# EAGLE design Dual_7seg_Rev0 (EAGLE 7.7.0)
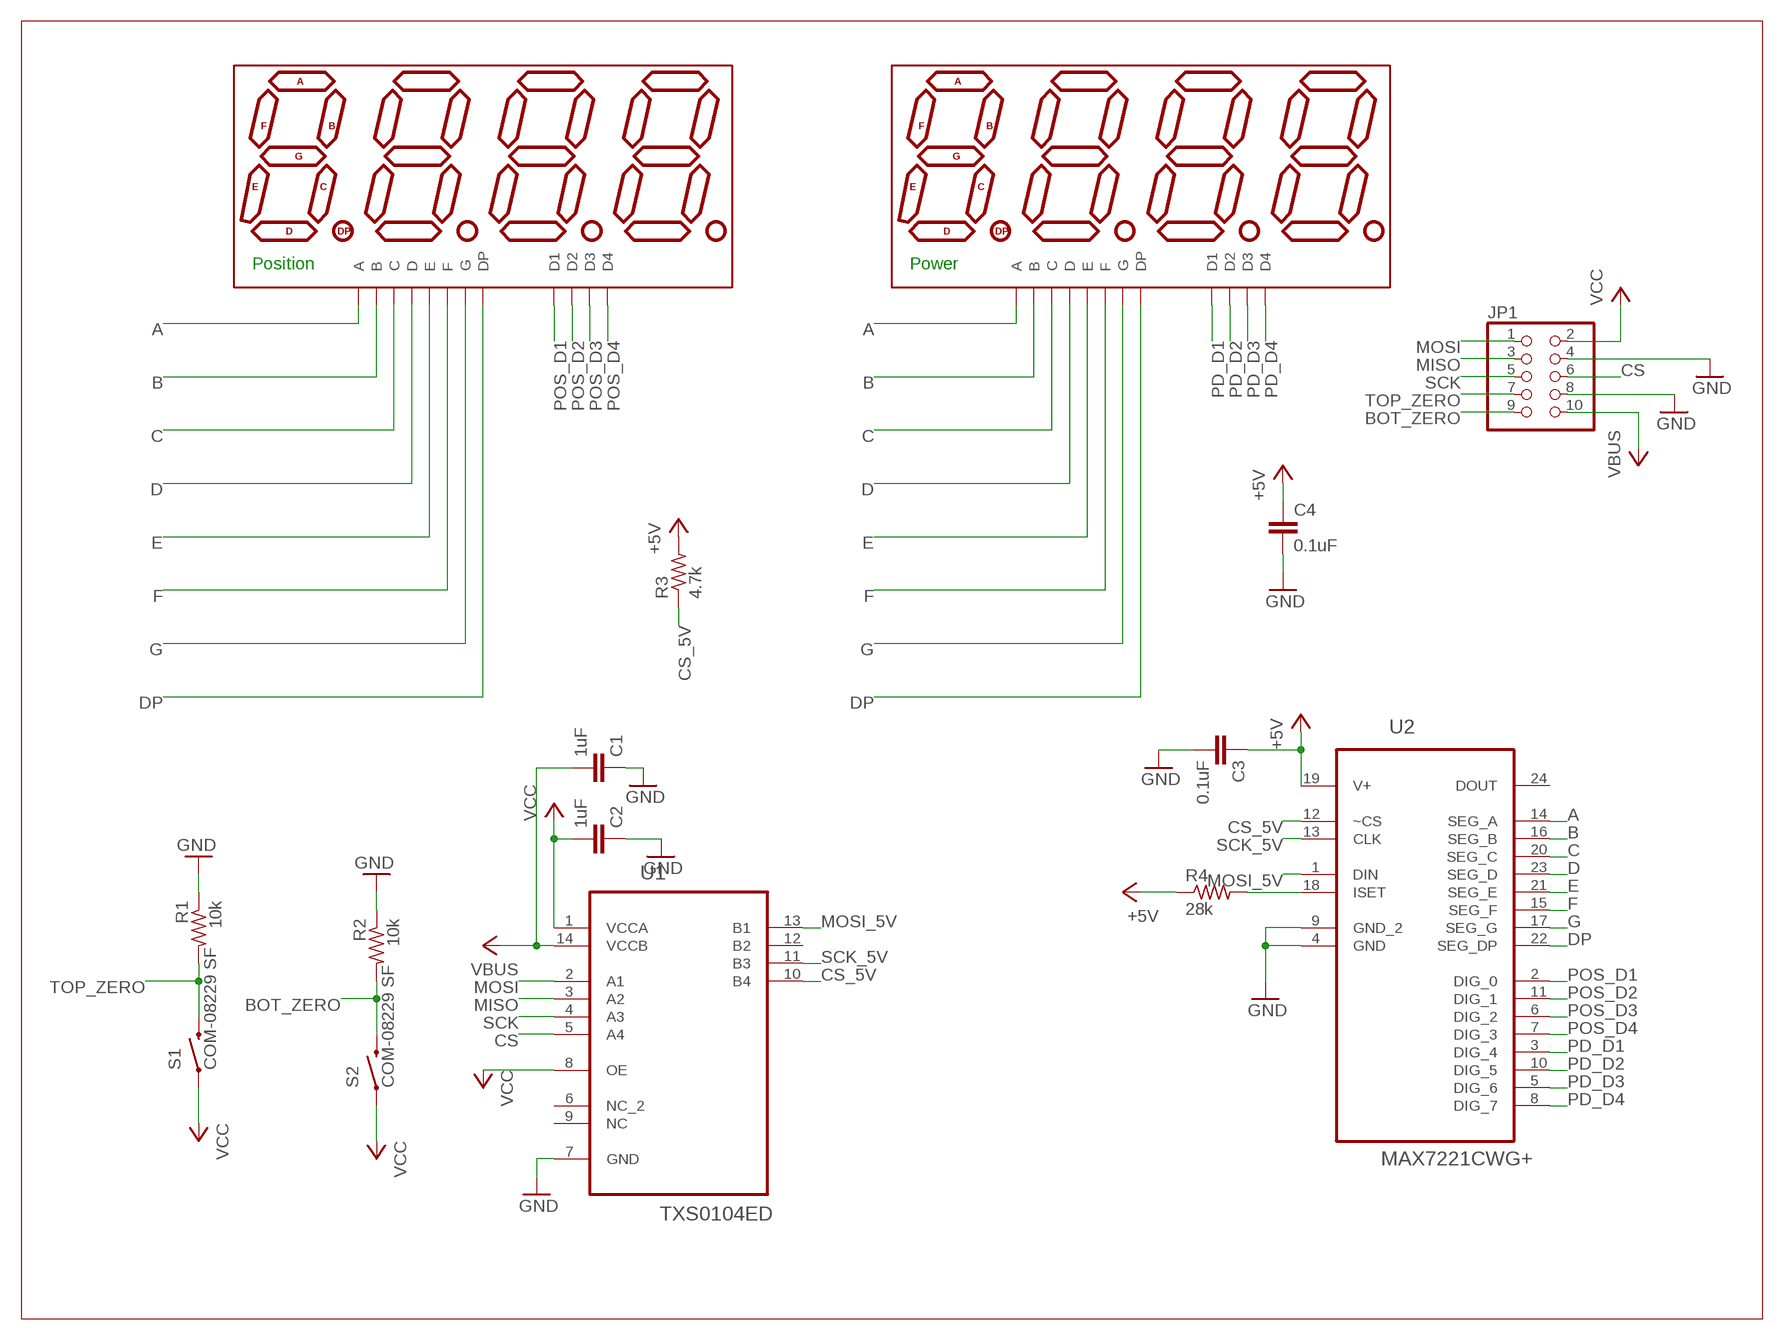
[diagram p0: schematic, sheet 1]

## Parts
C1  1uF  C-EUC0402  [C0402]
C2  1uF  C-EUC0402  [C0402]
C3  0.1uF  C-EUC0402  [C0402]
C4  0.1uF  C-EUC0402  [C0402]
DISP1  ATA8041AW  7-SEGMENT-4DIGIT-20MM-WHITE  [7-SEGMENT-4DIGIT-20MM]
DISP2  ATA8041AW  7-SEGMENT-4DIGIT-20MM-WHITE  [7-SEGMENT-4DIGIT-20MM]
JP1  PINHD-2X5  [2X05]
R1  10k  R-US_R0402  [R0402]
R2  10k  R-US_R0402  [R0402]
R3  4.7k  R-US_R0402  [R0402]
R4  28k  R-US_R0402  [R0402]
S1  COM-08229 SF  SWITCH-MOMENTARY-2SMD-1101NE  [TACTILE-SWITCH-1101NE]
S2  COM-08229 SF  SWITCH-MOMENTARY-2SMD-1101NE  [TACTILE-SWITCH-1101NE]
U1  TXS0104ED  [SOIC127P600X175-14N]
U2  MAX7221CWG+  [SOIC127P1032X265-24N]

## Nets
+5V: C1.2 C3.1 C4.1 JP1.10 R3.2 R4.1 U1.14(VCCB) U2.19(V+) ; supply symbol labelled VBUS
A: DISP1.11(A) DISP2.11(A) U2.14(SEG_A)
B: DISP1.7(B) DISP2.7(B) U2.16(SEG_B)
BOT_ZERO: JP1.9 R2.2 S2.2
C: DISP1.4(C) DISP2.4(C) U2.20(SEG_C)
CS: JP1.6 U1.5(A4)
CS_5V: R3.1 U1.10(B4) U2.12(~CS)
D: DISP1.2(D) DISP2.2(D) U2.23(SEG_D)
DP: DISP1.3(DP) DISP2.3(DP) U2.22(SEG_DP)
E: DISP1.1(E) DISP2.1(E) U2.21(SEG_E)
F: DISP1.10(F) DISP2.10(F) U2.15(SEG_F)
G: DISP1.5(G) DISP2.5(G) U2.17(SEG_G)
GND: C1.1 C2.1 C3.2 C4.2 JP1.4 JP1.8 R1.1 R2.1 U1.7(GND) U2.4(GND) U2.9(GND_2)
MISO: JP1.3 U1.3(A2)
MOSI: JP1.1 U1.2(A1)
MOSI_5V: U1.13(B1) U2.1(DIN)
N$1: R4.2 U2.18(ISET)
PD_D1: DISP2.12(D1) U2.3(DIG_4)
PD_D2: DISP2.9(D2) U2.10(DIG_5)
PD_D3: DISP2.8(D3) U2.5(DIG_6)
PD_D4: DISP2.6(D4) U2.8(DIG_7)
POS_D1: DISP1.12(D1) U2.2(DIG_0)
POS_D2: DISP1.9(D2) U2.11(DIG_1)
POS_D3: DISP1.8(D3) U2.6(DIG_2)
POS_D4: DISP1.6(D4) U2.7(DIG_3)
SCK: JP1.5 U1.4(A3)
SCK_5V: U1.11(B3) U2.13(CLK)
TOP_ZERO: JP1.7 R1.2 S1.2
VCC: C2.2 JP1.2 S1.1 S2.1 U1.1(VCCA) U1.8(OE)
Unconnected: U1.6(NC_2) U1.9(NC) U1.12(B2) U2.24(DOUT)

## Notes on the sheet
- Position | Power

## Library data of the parts
C1-C4 = rcl:C-EU: CAPACITOR, European symbol
DISP1 DISP2 = SparkFun-LED:7-SEGMENT-4DIGIT-20MM: 4 Digit 7 Segment Display This is a part for the 4-Digit 7-segment LEDs from Young Sun. Different from the Digikey LEDs, all 16 pins are used. The LONGPADS Variant is used for a test jig, but you may like it because there is more pad to solder to. If you are concerned about routing space, the standard works just fine though. Datasheets: Red <http://cdn.sparkfun.com/datasheets/Components/LED/1LEDREDCC.pdf> Yellow <http://cdn.sparkfun.com/datasheets/Components/LED/1LEDYELCC.pdf> Green <http://cdn.sparkfun.com/datasheets/Components/LED/1LEDGRNCC.pdf> Blue <http://cdn.sparkfun.com/datasheets/Components/LED/1LEDBLUCC.pdf> White <http://cdn.sparkfun.com/datasheets/Components/LED/1LEDWHTCC.pdf> SparkFun Products Raw Components 7-Segment Display - 20mm (Red) <https://www.sparkfun.com/products/11405> (COM-11405) 7-Segment Display - 20mm (Yellow) <https://www.sparkfun.com/products/11406> (COM-11406) 7-Segment Display - 20mm (Green) <https://www.sparkfun.com/products/11407> (COM-11407) 7-Segment Display - 20mm (Blue) <https://www.sparkfun.com/products/11408> (COM-11408) 7-Segment Display - 20mm (White) <https://www.sparkfun.com/products/11409> (COM-11409) Serial Controlled SparkFun OpenSegment Serial Display - 20mm (Red) <https://www.sparkfun.com/products/11644> (COM-11644) SparkFun OpenSegment Serial Display - 20mm (Yellow) <https://www.sparkfun.com/products/11645> (COM-11645) SparkFun OpenSegment Serial Display - 20mm (Green) <https://www.sparkfun.com/products/11646> (COM-11646) SparkFun OpenSegment Serial Display - 20mm (Blue) <https://www.sparkfun.com/products/11647> (COM-11647) SparkFun OpenSegment Serial Display - 20mm (White) <https://www.sparkfun.com/products/11648> (COM-11648) Other SparkFun OpenSegment Shield <https://www.sparkfun.com/products/13190> (DEV-13190); PROD_ID: COMP-11445
JP1 = pinhead:PINHD-2X5: PIN HEADER
R1-R4 = resistor:R-US_: RESISTOR, American symbol
S1 S2 = SparkFun-Electromechanical:SWITCH-MOMENTARY-2: Various NO switches- pushbuttons, reed, etc; PROD_ID: SWCH-00815
U1 = Texas Instruments_By_element14_Batch_1:TXS0104ED: 4-BIT BIDIRECTIONAL VOLTAGE-LEVEL TRANSLATOR FOR OPEN-DRAIN AND PUSH-PULL APPLICATIONS; MPN: TXS0104ED; OC_FARNELL: 1607892; OC_NEWARK: 10M0686; PACKAGE: SOIC-14; SUPPLIER: TEXAS INSTRUMENTS
U2 = Maxim_By_element14_Batch_1:MAX7221CWG+: Serially Interfaced, 8-Digit LED Display Drivers; MPN: MAX7221CWG+; OC_FARNELL: 9725725; OC_NEWARK: 59J6394; PACKAGE: SOIC-24; SUPPLIER: Maxim

## Net classes
0 default: width 0.152 mm, drill 0.33 mm, clearance 0.152 mm
1 PWR: width 0.254 mm, drill 0.508 mm, clearance 0.254 mm to class 0, clearance 0.254 mm

## Board
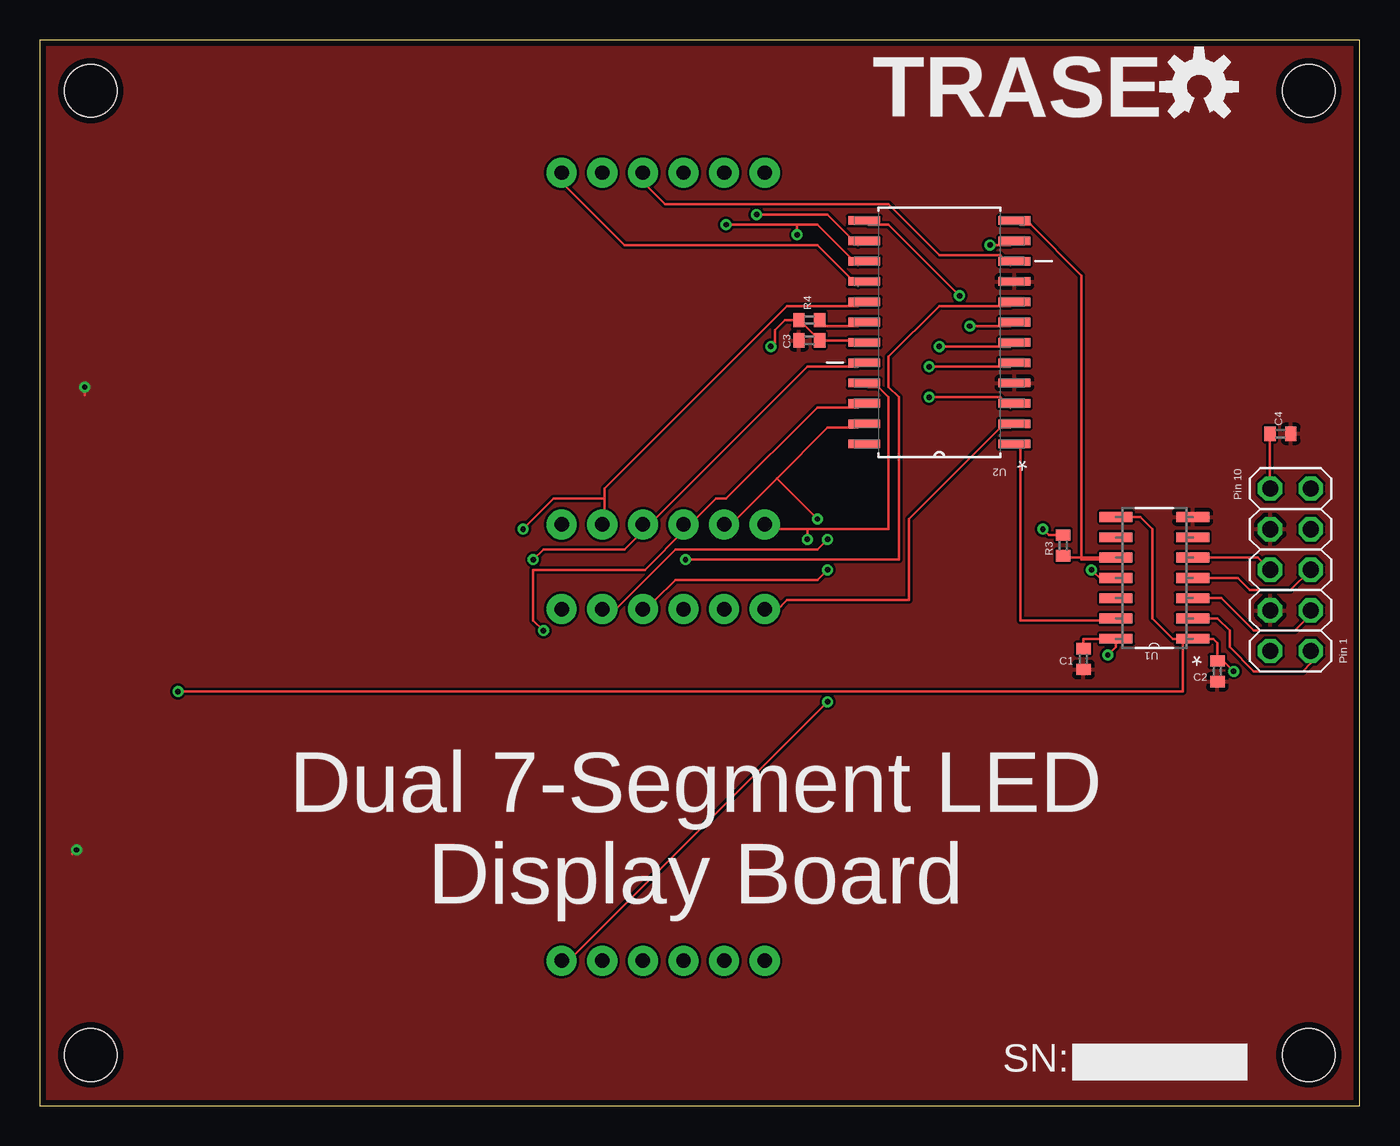
[diagram p1: board, top side]
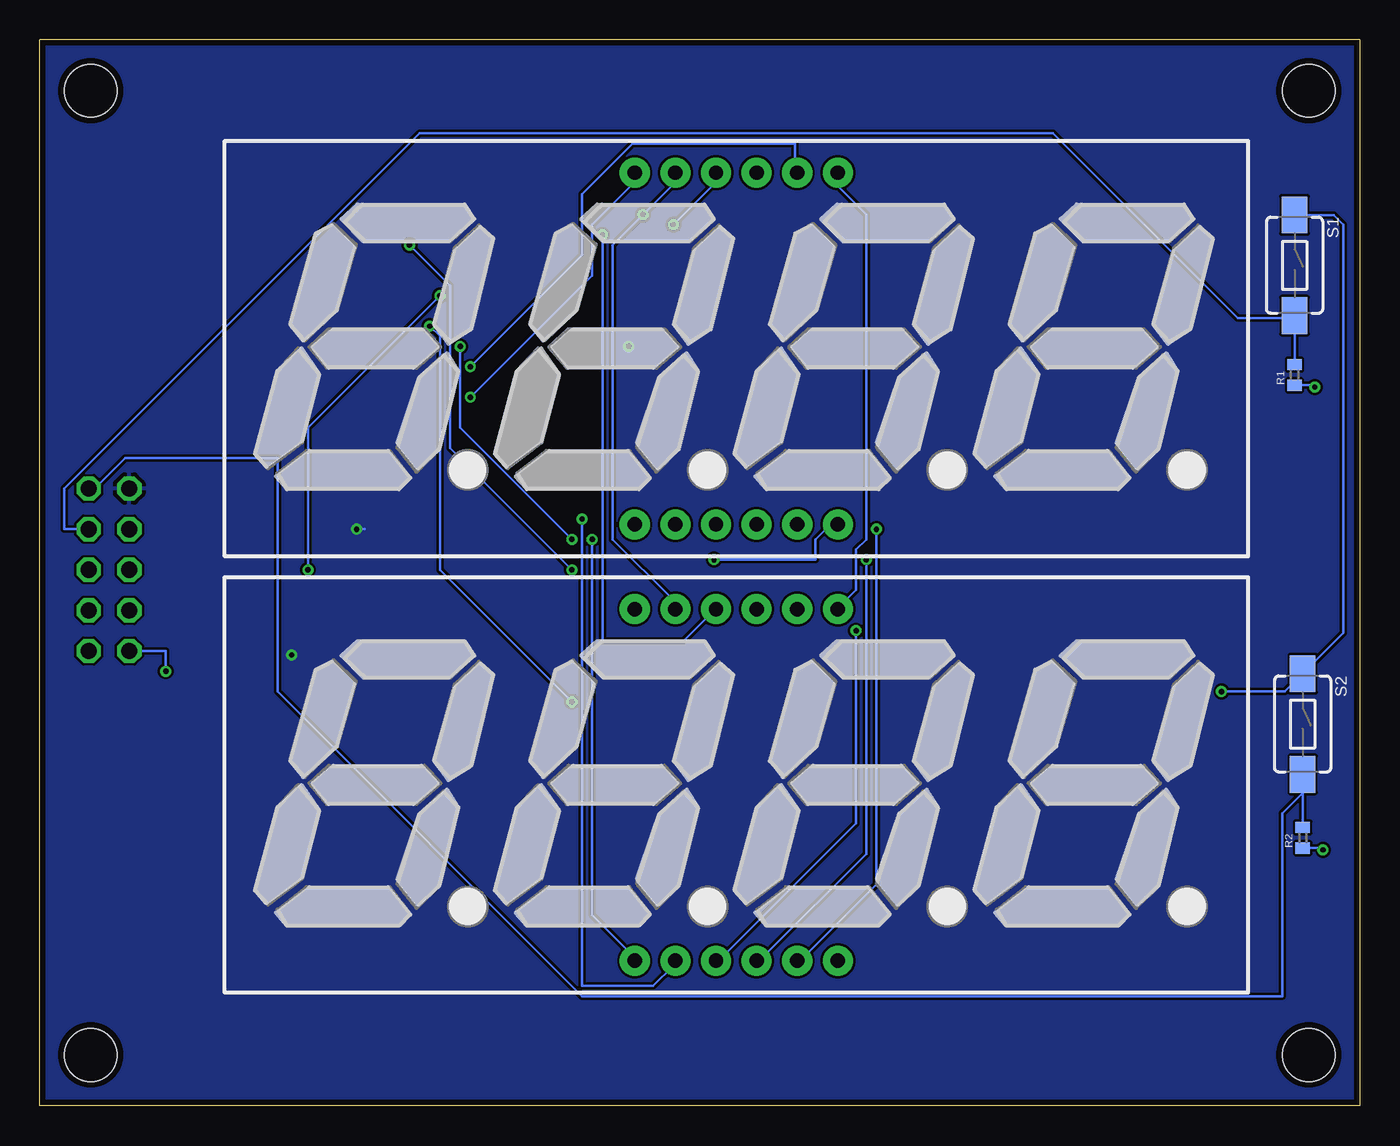
[diagram p2: board, bottom side, seen from below]

Size 82.55 x 66.67 mm. Coordinates in mm from the lower left corner, seen from the top.
Outline: 0,0 82.55,0 82.55,66.67 0,66.67 0,0
Copper layers (1*16): Top 0.0356mm / dielectric 1.5011mm / Bottom 0.0356mm
Design rules "oshpark-2layer": minimum track width 6mil, minimum drill 13mil, track to track 6mil, track to pad 6mil, pad to pad 6mil, via to via 6mil, smd to smd 6mil, copper to edge 15mil, drill to drill 6mil, minimum pad ring 7mil, minimum via ring 7mil, stop-mask expansion 2.5mil, vias tented up to drill 0mil, thermal gap 10mil

### Footprints (pad centres in the part's own frame; a part is rotated, then mirrored left to right if it is on the bottom)
C0402 = smd 0.7 x 0.9: 1 -0.65,0; 2 0.65,0
7-SEGMENT-4DIGIT-20MM = drill 0.9 pad 1.88: 1 -6.35,-10.998; 2 -3.81,-10.998; 3 -1.27,-10.998; 4 1.27,-10.998; 5 3.81,-10.998; 6 6.35,-10.998; 7 6.35,10.998; 8 3.81,10.998; 9 1.27,10.998; 10 -1.27,10.998; 11 -3.81,10.998; 12 -6.35,10.998
2X05 = drill 1.016 octagon: 1 -5.08,-1.27; 2 -5.08,1.27; 3 -2.54,-1.27; 4 -2.54,1.27; 5 0,-1.27; 6 0,1.27; 7 2.54,-1.27; 8 2.54,1.27; 9 5.08,-1.27; 10 5.08,1.27
R0402 = smd 0.7 x 0.9: 1 -0.65,0; 2 0.65,0
TACTILE-SWITCH-1101NE = smd 2.3 x 1.6: 1 -3.15,0; 2 3.15,0
SOIC127P600X175-14N = smd 2.057 x 0.61: 1 -4.801,7.62; 2 -4.801,6.35; 3 -4.801,5.08; 4 -4.801,3.81; 5 -4.801,2.54; 6 -4.801,1.27; 7 -4.801,0; 8 0,0; 9 0,1.27; 10 0,2.54; 11 0,3.81; 12 0,5.08; 13 0,6.35; 14 0,7.62
SOIC127P1032X265-24N = smd 1.981 x 0.533: 1 -4.699,6.985; 2 -4.699,5.715; 3 -4.699,4.445; 4 -4.699,3.175; 5 -4.699,1.905; 6 -4.699,0.635; 7 -4.699,-0.635; 8 -4.699,-1.905; 9 -4.699,-3.175; 10 -4.699,-4.445; 11 -4.699,-5.715; 12 -4.699,-6.985; 13 4.699,-6.985; 14 4.699,-5.715; 15 4.699,-4.445; 16 4.699,-3.175; 17 4.699,-1.905; 18 4.699,-0.635; 19 4.699,0.635; 20 4.699,1.905; 21 4.699,3.175; 22 4.699,4.445; 23 4.699,5.715; 24 4.699,6.985
STAND-OFF = hole 3.302: 0,0

### Placement (x,y rotation side)
C1  65.28,27.94 90 top
C2  73.66,27.18 90 top
C3  48.13,47.88 180 top
C4  77.6,42.04 0 top
DISP1  38.99,20.07 0 bottom
DISP2  38.99,47.37 0 bottom
JP1  78.23,33.53 90 top
R1  4.06,45.72 90 bottom
R2  3.56,16.76 90 bottom
R3  64.01,35.05 90 top
R4  48.13,49.15 0 top
S1  4.06,52.58 270 bottom
S2  3.56,23.88 270 bottom
U1  67.31,36.83 180 top
U2  56.26,48.39 180 top
U$1  [STAND-OFF]  3.17,3.17 0 top
U$2  [STAND-OFF]  79.38,3.17 0 top
U$3  [STAND-OFF]  79.38,63.5 0 top
U$4  [OSHW-LOGO-M]  72.52,63.75 0 top
U$5  [STAND-OFF]  3.17,63.5 0 top

### Tracks (layer width: path | path; a pad name or v marks a point on that pad's centre or on a via)
+5V  (via drill 0.33)
  Top 0.152: v66.8,28.19 67.31,28.7 U1.14 65.28,29.21 C1.2 | R3.2 63.1,35.7 v62.74,36.07 | C4.1 76.95,38.62 JP1.10 | v45.72,47.5 45.97,47.75 45.97,48.51 46.61,49.15 R4.1 47.51,49.15 C3.1 51.44,47.88 U2.19
  Bottom 0.152: v66.8,28.19 66.8,27.94 | v62.74,36.07 62.23,36.07 | v45.72,47.5 45.47,47.5
  pour Bottom: 0,0 0,66.67 82.55,66.67 82.55,0
A  (via drill 0.33)
  Top 0.152: v44.83,55.75 49.28,55.75 51.18,53.85 U2.14
  Bottom 0.152: DISP2.11 42.93,58.29 42.93,57.66 v44.83,55.75 46.74,53.85 46.74,35.43 42.93,31.62 DISP1.11
B
  Top 0.152: U2.16 51.18,51.31 48.64,53.85 36.58,53.85 32.13,58.29 DISP2.7
  Bottom 0.152: DISP1.7 32.13,31.62 31.5,32.26 31.5,34.8 30.86,35.43 30.86,55.75 32.77,57.66 32.77,58.29 DISP2.7
BOT_ZERO
  Bottom 0.152: R2.2 3.56,19.56 | 3.56,19.56 S2.2 | 3.56,19.56 4.83,18.29 4.83,6.86 48.64,6.86 67.69,25.91 67.69,40.51 77.22,40.51 79.12,38.61 JP1.9
C  (via drill 0.33)
  Top 0.152: U2.20 51.18,46.23 48.01,46.23 38.48,36.7 37.85,36.7 DISP2.4 37.85,36.07 36.58,34.8 31.5,34.8 v30.86,34.16
  Bottom 0.152: v30.86,34.16 30.86,15.75 37.21,9.4 DISP1.4
CS
  Top 0.152: U1.5 76.2,34.29 JP1.6
CS_5V
  Top 0.152: R3.1 64.12,34.29 U1.10 67.06,34.16 65.15,34.16 65.15,51.94 61.98,55.12 61.34,55.12 U2.12
D  (via drill 0.33)
  Top 0.152: 46.1,39.24 43.56,36.7 42.93,36.7 DISP2.2 | 46.1,39.24 49.28,42.42 51.18,42.42 U2.23 | 46.1,39.24 v48.64,36.7
  Bottom 0.152: v48.64,36.7 48.64,7.49 44.2,7.49 42.93,8.76 DISP1.2
DP  (via drill 0.33)
  Top 0.152: U2.22 51.18,43.69 48.64,43.69 42.93,37.97 42.29,37.97 41.02,36.7 40.39,36.7 DISP2.3 40.39,36.07 37.85,33.53 30.86,33.53 30.86,30.35 v31.5,29.72
  Bottom 0.152: v31.5,29.72 31.5,17.65 39.75,9.4 DISP1.3
E  (via drill 0.33)
  Top 0.152: 48.01,36.07 45.47,36.07 DISP2.1 | 48.01,36.07 53.09,36.07 53.09,44.32 52.45,44.96 51.82,44.96 U2.21 | 48.01,36.07 v48.01,35.43
  Bottom 0.152: v48.01,35.43 48.01,11.94 45.47,9.4 DISP1.1
F  (via drill 0.33)
  Top 0.152: v42.93,55.12 47.37,55.12 | 47.37,55.12 48.64,55.12 51.18,52.58 U2.15 | 47.37,55.12 v47.37,54.48
  Bottom 0.152: v42.93,55.12 40.39,57.66 40.39,58.29 DISP2.10 | v47.37,54.48 47.37,29.08 42.29,29.08 40.39,30.99 DISP1.10
G  (via drill 0.33)
  Top 0.152: 35.31,37.97 35.31,36.7 DISP2.5 | 35.31,37.97 35.31,38.61 46.74,50.04 51.18,50.04 U2.17 | v30.23,36.07 32.13,37.97 35.31,37.97
  Bottom 0.152: v30.23,36.07 30.23,13.84 34.67,9.4 DISP1.5
GND  (via drill 0.33)
  Top 0.152: v2.29,16 2.03,15.75 | v2.79,44.96 2.79,44.45
  Bottom 0.152: R2.1 2.4,16.11 v2.29,16 | R1.1 2.91,45.07 v2.79,44.96
  pour Top: 0,0 0,66.67 82.55,66.67 82.55,0
MISO
  Top 0.152: U1.3 73.91,31.75 75.95,29.72 78.49,29.72 79.25,30.48 79.25,30.73 JP1.3
MOSI
  Top 0.152: JP1.1 79.5,27.69 78.99,27.18 75.95,27.18 74.42,28.7 74.42,29.72 73.66,30.48 U1.2
MOSI_5V
  Top 0.152: U2.1 61.34,41.15 61.34,30.35 67.06,30.35 U1.13
N$1
  Top 0.152: R4.2 48.64,48.77 51.18,48.77 U2.18
PD_D1  (via drill 0.33)
  Top 0.152: v55.63,44.32 60.07,44.32 60.71,43.69 U2.3
  Bottom 0.152: v55.63,44.32 48.01,51.94 48.01,55.12 45.47,57.66 45.47,58.29 DISP2.12
PD_D2
  Top 0.152: U2.10 60.71,52.58 60.07,53.21 56.26,53.21 53.09,56.39 39.12,56.39 37.21,58.29 DISP2.9
PD_D3  (via drill 0.33)
  Top 0.152: v55.63,46.23 60.71,46.23 U2.5
  Bottom 0.152: v55.63,46.23 48.64,53.21 48.64,57.02 45.47,60.2 35.31,60.2 35.31,58.93 DISP2.8
PD_D4  (via drill 0.33)
  Top 0.152: v40.39,34.16 53.72,34.16 53.72,44.32 53.09,44.96 53.09,46.86 56.26,50.04 60.71,50.04 U2.8
  Bottom 0.152: v40.39,34.16 34.04,34.16 34.04,35.43 32.77,36.7 DISP2.6
POS_D1
  Top 0.152: U2.2 60.71,42.42 60.07,42.42 54.36,36.7 54.36,31.62 46.74,31.62 46.1,30.99 45.47,30.99 DISP1.12
POS_D2  (via drill 0.33)
  Top 0.152: v59.44,53.85 60.71,53.85 U2.11 | v49.28,33.53 48.64,32.89 39.75,32.89 38.48,31.62 37.85,31.62 DISP1.9
  Bottom 0.152: v59.44,53.85 56.9,51.31 56.9,41.15 v49.28,33.53
POS_D3  (via drill 0.33)
  Top 0.152: v56.26,47.5 60.71,47.5 U2.6 | v49.28,35.43 48.64,34.8 39.75,34.8 35.94,30.99 35.31,30.99 DISP1.8
  Bottom 0.152: v56.26,47.5 56.26,42.42 v49.28,35.43
POS_D4  (via drill 0.33)
  Top 0.152: v58.17,48.77 60.71,48.77 U2.7 | v49.28,25.27 33.4,9.4 32.77,9.4 DISP1.6
  Bottom 0.152: v58.17,48.77 57.53,48.13 57.53,33.53 v49.28,25.27
SCK
  Top 0.152: U1.4 74.93,33.02 75.69,32.26 78.23,32.26 JP1.5
SCK_5V  (via drill 0.33)
  Top 0.152: v57.53,50.67 53.09,55.12 51.82,55.12 U2.13 | v65.79,33.53 66.42,32.89 67.06,32.89 U1.11
  Bottom 0.152: v57.53,50.67 65.79,42.42 v65.79,33.53
TOP_ZERO
  Bottom 0.152: JP1.7 81.03,36.07 81.03,38.61 58.8,60.83 19.18,60.83 7.62,49.28 4.22,49.28 S1.2 R1.2
VCC  (via drill 0.33)
  Top 0.152: U1.8 68.83,36.83 69.6,36.07 69.6,30.48 70.87,29.21 U1.1 | U1.1 73.41,29.21 73.66,28.96 C2.2 74.04,27.81 v74.68,27.18 | v8.64,25.91 71.5,25.91 71.5,29.08 U1.1
  Bottom 0.152: JP1.2 74.68,28.45 v74.68,27.18 | 3.56,27.18 S2.1 | S1.1 1.63,55.73 1.02,55.12 1.02,29.57 S2.1 | v8.64,25.91 4.67,25.91 S2.1

### Text on the board
tPlace: TRASE | Pin 10 | Pin 1 | Dual 7-Segment LED / Display Board | SN: